# EAGLE design PI_Shield (EAGLE 9.6.2)

## Sheet 1 of 3
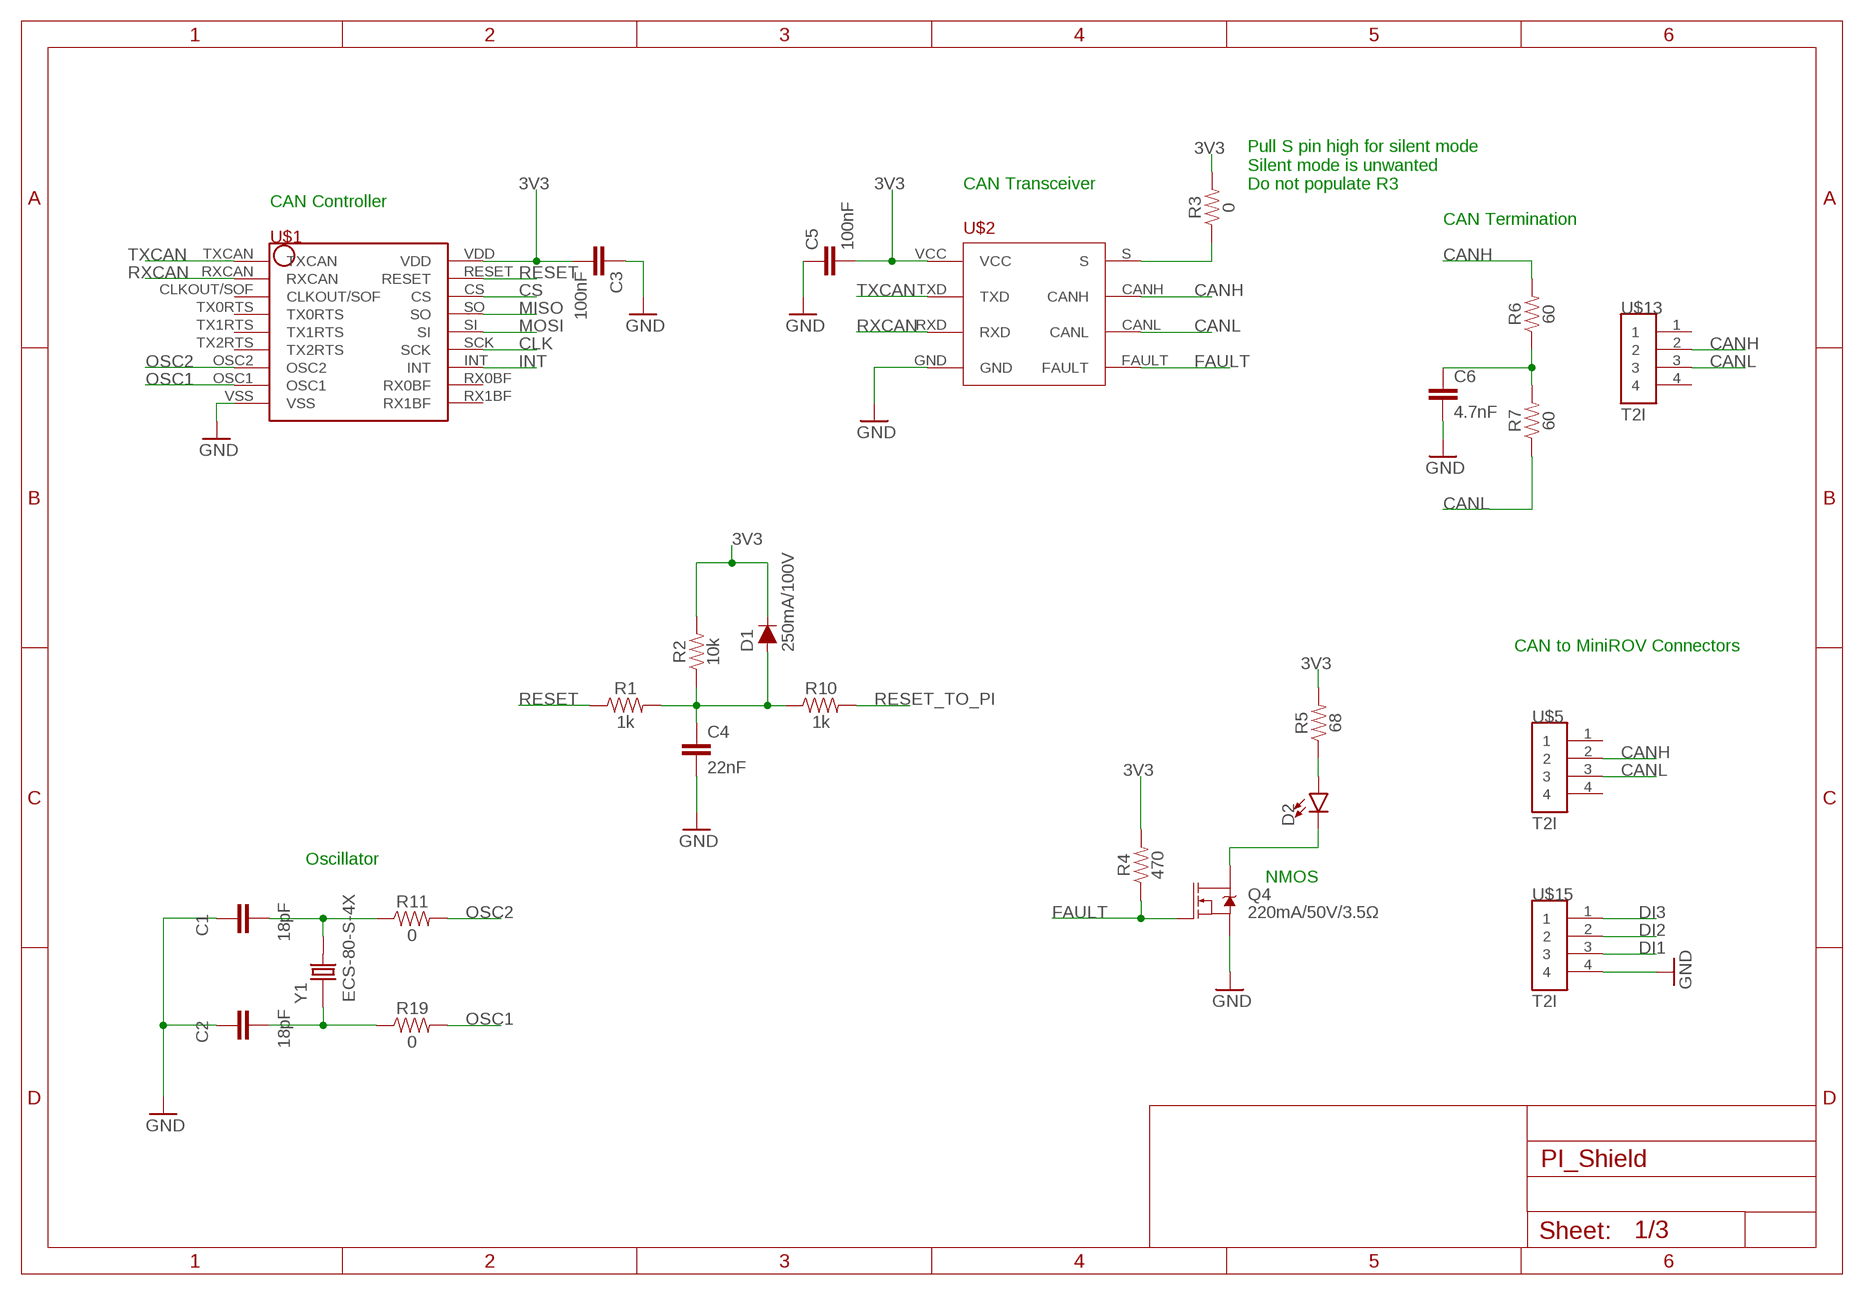
[diagram p0: schematic, sheet 1]

### Parts
C1  18pF  C0603C180J5GACTU  [CAP_0603]
C2  18pF  C0603C180J5GACTU  [CAP_0603]
C3  100nF  22NF/22,000PF-0603-50V-10%  [0603]
C4  22nF  22NF/22,000PF-0603-50V-10%  [0603]
C5  100nF  22NF/22,000PF-0603-50V-10%  [0603]
C6  4.7nF  22NF/22,000PF-0603-50V-10%  [0603]
D1  250mA/100V  DIODE-BAS16J  [SOD-323]
D2  LED0603  [LED-0603]
Q4  220mA/50V/3.5Ω  MOSFET-NCH-BSS138  [SOT23-3]
R1  1k  RESISTOR0603  [0603]
R2  10k  RESISTOR0603  [0603]
R3  0  RESISTOR0603  [0603]
R4  470  RESISTOR0603  [0603]
R5  68  RESISTOR0603  [0603]
R6  60  RESISTOR0603  [0603]
R7  60  RESISTOR0603  [0603]
R10  1k  RESISTOR0603  [0603]
R11  0  RESISTOR0603  [0603]
R19  0  RESISTOR0603  [0603]
U$1  MCP2515  [MCP2515]
U$2  TCAN337D  [TCAN337D]
U$5  T2I  [T2I]
U$13  T2I  [T2I]
U$15  T2I  [T2I]
Y1  ECS-80-S-4X  [XTAL_ECS-80-S-4X]

### Nets
3V3: C3.2 C5.2 D1.C R2.2 R3.2 R4.2 R5.2 U$1.VDD U$2.VCC ; also sheet 2,3
CANH: R6.2 U$2.CANH U$5.2 U$13.2 ; also sheet 2
CANL: R7.1 U$2.CANL U$5.3 U$13.3 ; also sheet 2
CLK: U$1.SCK ; also sheet 2
CS: U$1.CS ; also sheet 2
DI1: U$15.3 ; also sheet 2
DI2: U$15.2 ; also sheet 2
DI3: U$15.1 ; also sheet 2
FAULT: Q4.1(G) R4.1 U$2.FAULT
GND: C1.1 C2.1 C3.1 C4.2 C5.1 C6.2 Q4.2(S) U$1.VSS U$2.GND U$15.4 ; also sheet 2,3
INT: U$1.INT ; also sheet 2
MISO: U$1.SO ; also sheet 2
MOSI: U$1.SI ; also sheet 2
N$1: R3.1 U$2.S
N$2: C1.2 R11.1 Y1.2
N$3: C2.2 R19.1 Y1.1
N$6: C6.1 R6.1 R7.2
N$7: D2.C Q4.3(D)
N$8: D2.A R5.1
N$9: C4.1 D1.A R1.2 R2.1 R10.1
OSC1: R19.2 U$1.OSC1
OSC2: R11.2 U$1.OSC2
RESET: R1.1 U$1.RESET
RESET_TO_PI: R10.2 ; also sheet 2
RXCAN: U$1.RXCAN U$2.RXD
TXCAN: U$1.TXCAN U$2.TXD
Unconnected: U$1.CLKOUT/SOF U$1.RX0BF U$1.RX1BF U$1.TX0RTS U$1.TX1RTS U$1.TX2RTS U$5.1 U$5.4 U$13.1 U$13.4

### Notes on the sheet
- CAN Transceiver
- Pull S pin high for silent mode
  Silent mode is unwanted
  Do not populate R3
- CAN Controller
- CAN Termination
- CAN to MiniROV Connectors
- Oscillator
- NMOS

## Sheet 2 of 3
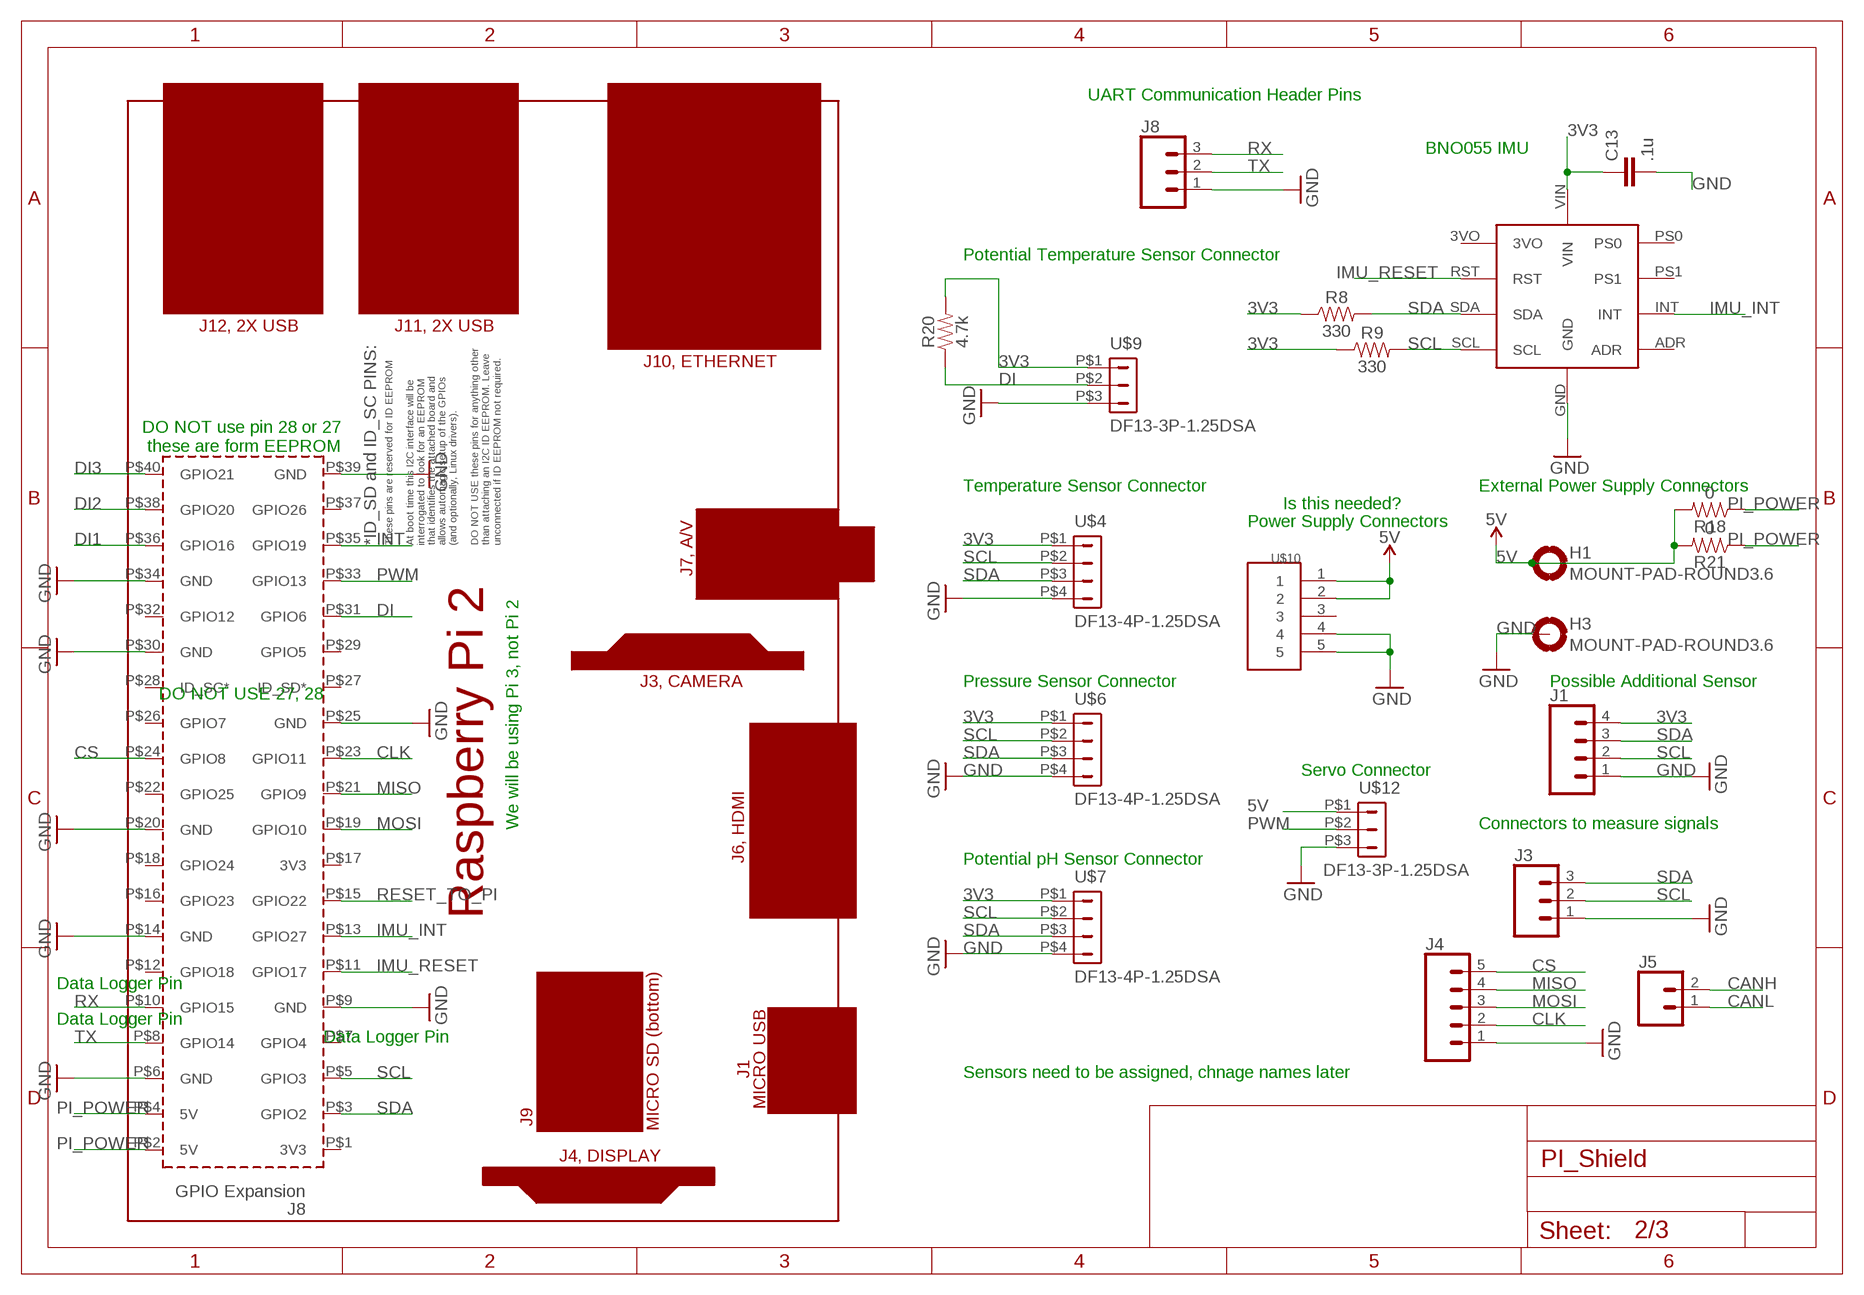
[diagram p1: schematic, sheet 2]

### Parts
C13  .1u  22NF/22,000PF-0603-50V-10%  [0603]
H1  MOUNT-PAD-ROUND3.6  [3,6-PAD]
H3  MOUNT-PAD-ROUND3.6  [3,6-PAD]
J1  CONN_04  [1X04]
J3  CONN_03  [1X03]
J4  CONN_05  [1X05]
J5  CONN_02  [1X02]
J8  CONN_03  [1X03]
PCB1  RPI2  [RPI2]
R8  330  RESISTOR0603  [0603]
R9  330  RESISTOR0603  [0603]
R18  0  RESISTOR0603  [0603]
R20  4.7k  RESISTOR0603  [0603]
R21  0  RESISTOR0603  [0603]
U$3  BNO055_9DOF_BREAKOUT  [BNO055]
U$4  DF13-4P-1.25DSA  [DF13-4P-1.25DSA]
U$6  DF13-4P-1.25DSA  [DF13-4P-1.25DSA]
U$7  DF13-4P-1.25DSA  [DF13-4P-1.25DSA]
U$9  DF13-3P-1.25DSA  [DF13-3P-1.25DSA]
U$10  T2I5P  [T2I5P]
U$12  DF13-3P-1.25DSA  [DF13-3P-1.25DSA]

### Nets
3V3: C13.1 J1.4 R8.1 R9.1 R20.2 U$3.VIN U$4.P$1 U$6.P$1 U$7.P$1 U$9.P$1 ; also sheet 1,3
5V: H1.B3,6(MOUNT) R18.2 R21.2 U$10.1 U$10.2 U$12.P$1 ; also sheet 3
CANH: J5.2 ; also sheet 1
CANL: J5.1 ; also sheet 1
CLK: J4.2 PCB1.P$23(GPIO11) ; also sheet 1
CS: J4.5 PCB1.P$24(GPIO8) ; also sheet 1
DI: PCB1.P$31(GPIO6) R20.1 U$9.P$2
DI1: PCB1.P$36(GPIO16) ; also sheet 1
DI2: PCB1.P$38(GPIO20) ; also sheet 1
DI3: PCB1.P$40(GPIO21) ; also sheet 1
GND: C13.2 H3.B3,6(MOUNT) J1.1 J3.1 J4.1 J8.1 PCB1.P$6(GND) PCB1.P$9(GND) PCB1.P$14(GND) PCB1.P$20(GND) PCB1.P$25(GND) PCB1.P$30(GND) PCB1.P$34(GND) PCB1.P$39(GND) U$3.GND U$4.P$4 U$6.P$4 U$7.P$4 U$9.P$3 U$10.4 U$10.5 U$12.P$3 ; also sheet 1,3
IMU_INT: PCB1.P$13(GPIO27) U$3.INT
IMU_RESET: PCB1.P$11(GPIO17) U$3.RST
INT: PCB1.P$35(GPIO19) ; also sheet 1
MISO: J4.4 PCB1.P$21(GPIO9) ; also sheet 1
MOSI: J4.3 PCB1.P$19(GPIO10) ; also sheet 1
PI_POWER: PCB1.P$2(5V) PCB1.P$4(5V) R18.1 R21.1
PWM: PCB1.P$33(GPIO13) U$12.P$2
RESET_TO_PI: PCB1.P$15(GPIO22) ; also sheet 1
RX: J8.3 PCB1.P$10(GPIO15)
SCL: J1.2 J3.2 PCB1.P$5(GPIO3) R9.2 U$3.SCL U$4.P$2 U$6.P$2 U$7.P$2 ; also sheet 3
SDA: J1.3 J3.3 PCB1.P$3(GPIO2) R8.2 U$3.SDA U$4.P$3 U$6.P$3 U$7.P$3 ; also sheet 3
TX: J8.2 PCB1.P$8(GPIO14)
Unconnected: PCB1.P$1(3V3) PCB1.P$7(GPIO4) PCB1.P$12(GPIO18) PCB1.P$16(GPIO23) PCB1.P$17(3V3) PCB1.P$18(GPIO24) PCB1.P$22(GPIO25) PCB1.P$26(GPIO7) PCB1.P$27(ID_SD*) PCB1.P$28(ID_SC*) PCB1.P$29(GPIO5) PCB1.P$32(GPIO12) PCB1.P$37(GPIO26) U$3.3VO U$3.ADR U$3.PS0 U$3.PS1 U$10.3

### Notes on the sheet
- UART Communication Header Pins
- BNO055 IMU
- Potential Temperature Sensor Connector
- DO NOT use pin 28 or 27
   these are form EEPROM
- Temperature Sensor Connector | External Power Supply Connectors
- Is this needed?
- Power Supply Connectors
- DO NOT USE 27, 28 | Pressure Sensor Connector | Possible Additional Sensor
- Servo Connector
- We will be using Pi 3, not Pi 2 | Connectors to measure signals
- Potential pH Sensor Connector
- Data Logger Pin
- Data Logger Pin
- Data Logger Pin
- Sensors need to be assigned, chnage names later

## Sheet 3 of 3
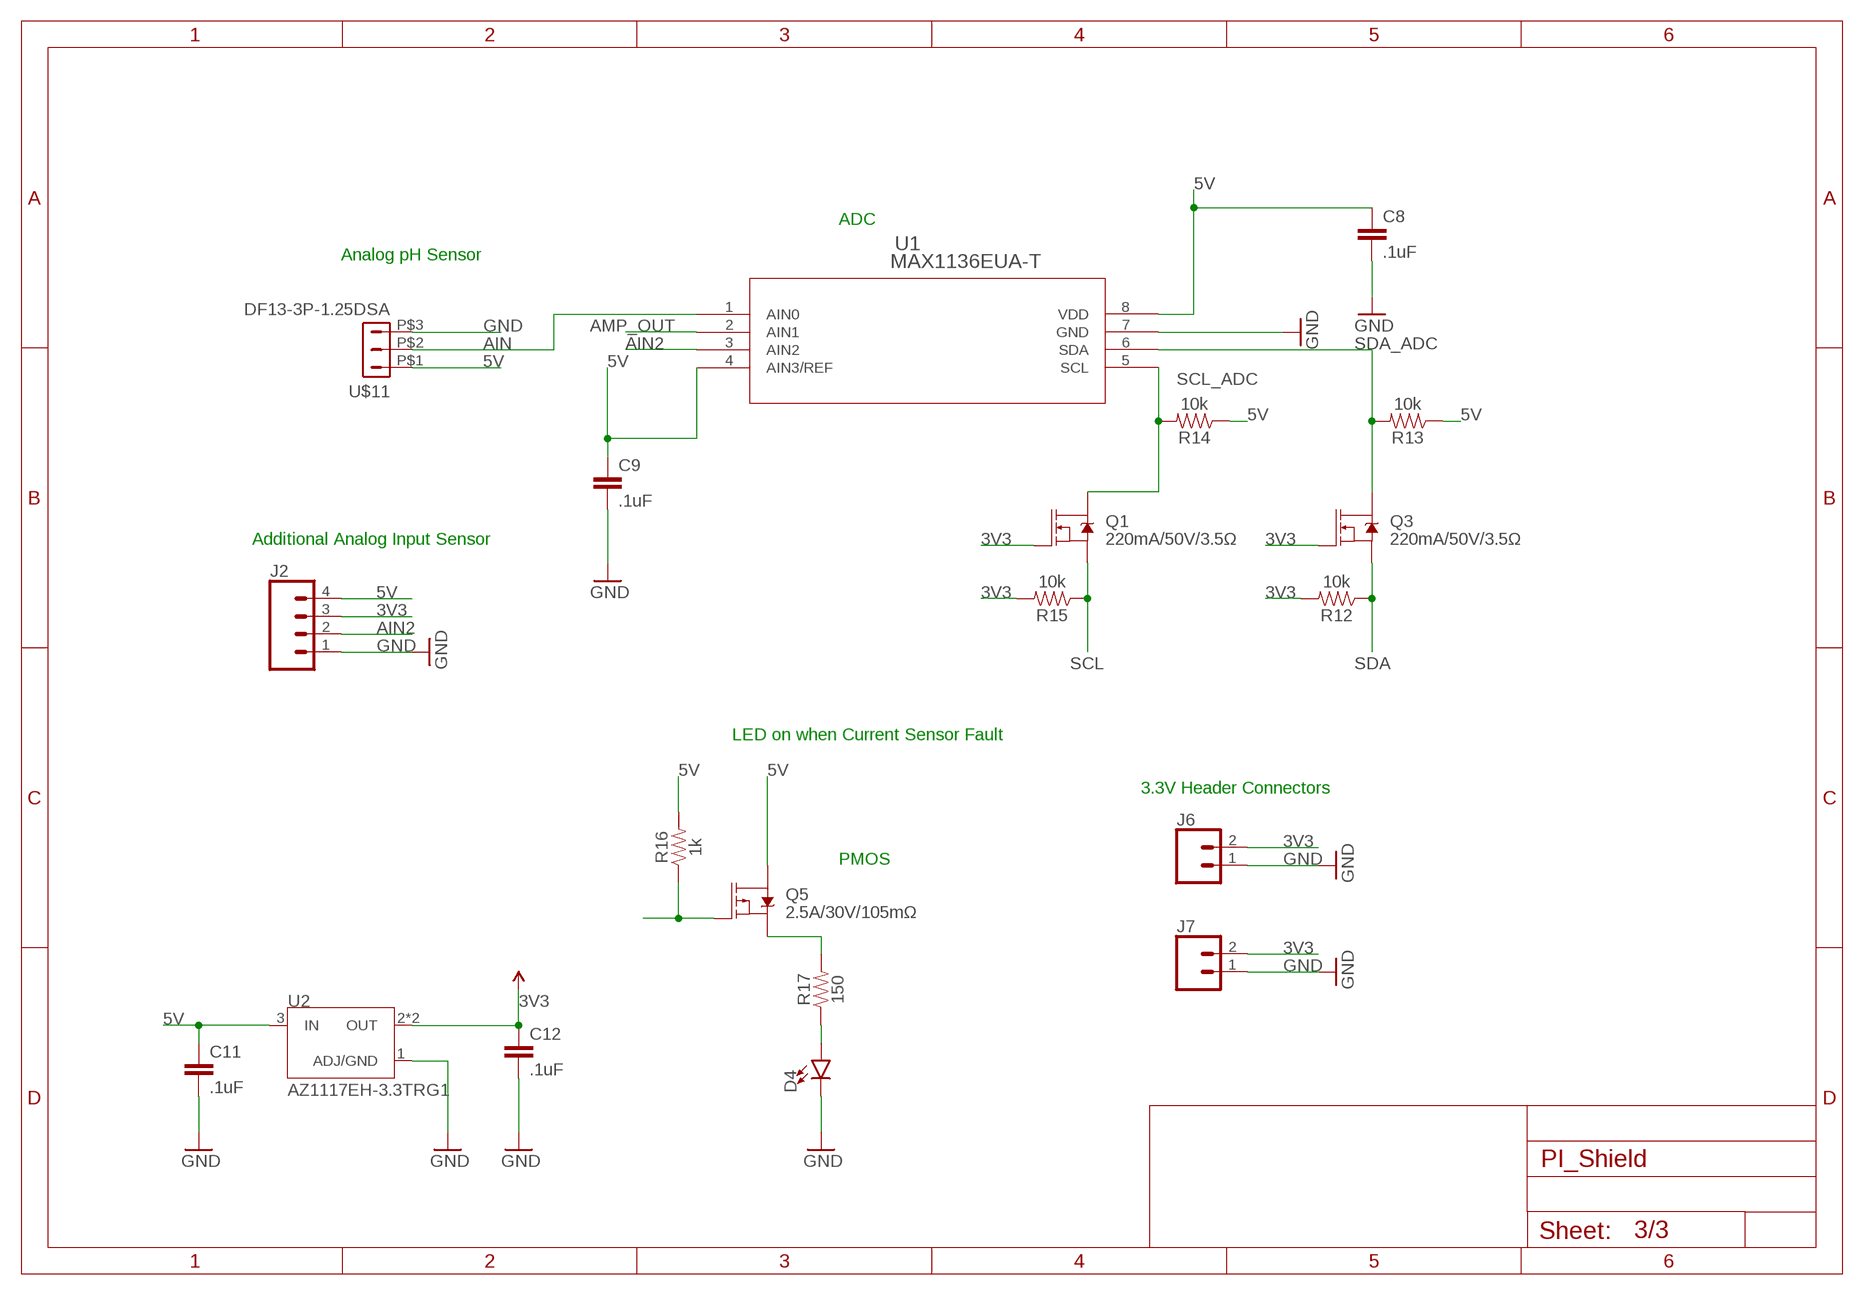
[diagram p2: schematic, sheet 3]

### Parts
C8  .1uF  22NF/22,000PF-0603-50V-10%  [0603]
C9  .1uF  22NF/22,000PF-0603-50V-10%  [0603]
C11  .1uF  22NF/22,000PF-0603-50V-10%  [0603]
C12  .1uF  22NF/22,000PF-0603-50V-10%  [0603]
D4  LED0603  [LED-0603]
J2  CONN_04  [1X04]
J6  CONN_02  [1X02]
J7  CONN_02  [1X02]
Q1  220mA/50V/3.5Ω  MOSFET-NCH-BSS138  [SOT23-3]
Q3  220mA/50V/3.5Ω  MOSFET-NCH-BSS138  [SOT23-3]
Q5  2.5A/30V/105mΩ  MOSFET_PCH-DMG2307L  [SOT23-3]
R12  10k  RESISTOR0603  [0603]
R13  10k  RESISTOR0603  [0603]
R14  10k  RESISTOR0603  [0603]
R15  10k  RESISTOR0603  [0603]
R16  1k  RESISTOR0603  [0603]
R17  150  RESISTOR0603  [0603]
U1  MAX1136EUA-T  [21-0036K]
U2  AZ1117EH-3.3TRG1  [SOT230P700X180-4N]
U$11  DF13-3P-1.25DSA  [DF13-3P-1.25DSA]

### Nets
3V3: C12.1 J2.3 J6.2 J7.2 Q1.1(G) Q3.1(G) R12.2 R15.2 U2.2(OUT) U2.4(OUT) ; supply symbol labelled 3.3V ; also sheet 1,2
5V: C8.1 C9.1 C11.1 J2.4 Q5.3(D) R13.1 R14.1 R16.2 U1.4(AIN3/REF) U1.8(VDD) U2.3(IN) U$11.P$1 ; also sheet 2
AIN: U1.1(AIN0) U$11.P$2
AIN2: J2.2 U1.3(AIN2)
AMP_FAULT: Q5.1(G) R16.1
AMP_OUT: U1.2(AIN1)
GND: C8.2 C9.2 C11.2 C12.2 D4.C J2.1 J6.1 J7.1 U1.7(GND) U2.1(ADJ/GND) U$11.P$3 ; also sheet 1,2
N$10: Q5.2(S) R17.2
N$11: D4.A R17.1
SCL: Q1.2(S) R15.1 ; also sheet 2
SCL_ADC: Q1.3(D) R14.2 U1.5(SCL)
SDA: Q3.2(S) R12.1 ; also sheet 2
SDA_ADC: Q3.3(D) R13.2 U1.6(SDA)

### Notes on the sheet
- ADC
- Analog pH Sensor
- Additional Analog Input Sensor
- LED on when Current Sensor Fault
- 3.3V Header Connectors
- PMOS

## Library data of the parts
C1 C2 = Resistor_Capacitor:C0603C180J5GACTU: CAP CER 18PF 50V C0G/NP0 0603 Manufacturer's datasheet <https://content.kemet.com/datasheets/KEM_C1003_C0G_SMD.pdf>; CREATED_BY: PCBLayout.com; DIGIKEY_PART_NUMBER: 399-1052-2-ND; MANUFACTURER: KEMET; MPN: C0603C180J5GACTU; PACKAGE: SMD 0603
C3 C5 C6 C8 C9 C11-C13 = SparkFun-Capacitors:22NF/22,000PF: 0.022uF/22nF/22,000pF ceramic capacitors A capacitor is a passive two-terminal electrical component used to store electrical energy temporarily in an electric field.; PROD_ID: CAP-07885; VALUE: 22nF
C4 = SparkFun-Capacitors:22NF/22,000PF: 0.022uF/22nF/22,000pF ceramic capacitors A capacitor is a passive two-terminal electrical component used to store electrical energy temporarily in an electric field.; PROD_ID: CAP-07885
D1 = SparkFun-DiscreteSemi:DIODE: Diode These are standard reverse protection diodes and small signal diodes. SparkFun Products: SparkFun SparkPunk Sound Kit <https://www.sparkfun.com/products/11177> SparkFun ESP8266 Thing <https://www.sparkfun.com/products/13231>; PROD_ID: DIO-09646
D2 D4 = SparkFun-LED:LED: LED (Generic) Standard schematic elements and footprints for 5mm, 3mm, 1206, and 0603 sized LEDs. Generic LEDs with no color specified.
H1 H3 = holes:MOUNT-PAD-ROUND: MOUNTING PAD, round
J1 J2 = SparkFun-Connectors:CONN_04: Multi connection point. Often used as Generic Header-pin footprint for 0.1 inch spaced/style header connections On any of the 0.1 inch spaced packages, you can populate with these: Break Away Headers - Straight <https://www.sparkfun.com/products/116> (PRT-00116) Break Away Male Headers - Right Angle <https://www.sparkfun.com/products/553> (PRT-00553) Female Headers <https://www.sparkfun.com/products/115> (PRT-00115) Break Away Headers - Machine Pin <https://www.sparkfun.com/products/117> (PRT-00117) Break Away Female Headers - Swiss Machine Pin <https://www.sparkfun.com/products/743> (PRT-00743) For SCREWTERMINALS and SPRING TERMINALS visit here: Screw Terimnals on SparkFun.com <https://www.sparkfun.com/search/results?term=Screw+Terminals> (5mm/3.5mm/2.54mm spacing) This device is also useful as a general connection point to wire up your design to another part of your project. Our various solder wires solder well into these plated through hole pads. Hook-Up Wire - Assortment (Stranded, 22 AWG) <https://www.sparkfun.com/products/11375> (PRT-11375) Hook-Up Wire - Assortment (Solid Core, 22 AWG) <https://www.sparkfun.com/products/11367> (PRT-11367) View the entire wire category on our website here <https://www.sparkfun.com/categories/141> Special notes: Molex polarized connector foot print use with SKU : PRT-08231 with associated crimp pins and housings. 1MM SMD Version SKU: PRT-10208; PROD_ID: CONN-09696
J3 J8 = SparkFun-Connectors:CONN_03: Multi connection point. Often used as Generic Header-pin footprint for 0.1 inch spaced/style header connections On any of the 0.1 inch spaced packages, you can populate with these: Break Away Headers - Straight <https://www.sparkfun.com/products/116> (PRT-00116) Break Away Male Headers - Right Angle <https://www.sparkfun.com/products/553> (PRT-00553) Female Headers <https://www.sparkfun.com/products/115> (PRT-00115) Break Away Headers - Machine Pin <https://www.sparkfun.com/products/117> (PRT-00117) Break Away Female Headers - Swiss Machine Pin <https://www.sparkfun.com/products/743> (PRT-00743) Stackable Header - 3 Pin (Female, 0.1") <https://www.sparkfun.com/products/13875> (PRT-13875) For SCREWTERMINALS and SPRING TERMINALS visit here: Screw Terimnals on SparkFun.com <https://www.sparkfun.com/search/results?term=Screw+Terminals> (5mm/3.5mm/2.54mm spacing) This device is also useful as a general connection point to wire up your design to another part of your project. Our various solder wires solder well into these plated through hole pads. Hook-Up Wire - Assortment (Stranded, 22 AWG) <https://www.sparkfun.com/products/11375> (PRT-11375) Hook-Up Wire - Assortment (Solid Core, 22 AWG) <https://www.sparkfun.com/products/11367> (PRT-11367) View the entire wire category on our website here <https://www.sparkfun.com/categories/141> Special notes: Molex polarized connector foot print use with SKU : PRT-08232 with associated crimp pins and housings.
J4 = SparkFun-Connectors:CONN_05: Multi connection point. Often used as Generic Header-pin footprint for 0.1 inch spaced/style header connections On any of the 0.1 inch spaced packages, you can populate with these: Break Away Headers - Straight <https://www.sparkfun.com/products/116> (PRT-00116) Break Away Male Headers - Right Angle <https://www.sparkfun.com/products/553> (PRT-00553) Female Headers <https://www.sparkfun.com/products/115> (PRT-00115) Break Away Headers - Machine Pin <https://www.sparkfun.com/products/117> (PRT-00117) Break Away Female Headers - Swiss Machine Pin <https://www.sparkfun.com/products/743> (PRT-00743) For SCREWTERMINALS and SPRING TERMINALS visit here: Screw Terimnals on SparkFun.com <https://www.sparkfun.com/search/results?term=Screw+Terminals> (5mm/3.5mm/2.54mm spacing) This device is also useful as a general connection point to wire up your design to another part of your project. Our various solder wires solder well into these plated through hole pads. Hook-Up Wire - Assortment (Stranded, 22 AWG) <https://www.sparkfun.com/products/11375> (PRT-11375) Hook-Up Wire - Assortment (Solid Core, 22 AWG) <https://www.sparkfun.com/products/11367> (PRT-11367) View the entire wire category on our website here <https://www.sparkfun.com/categories/141> Special notes: Molex polarized connector foot print use with SKU : PRT-08231 with associated crimp pins and housings. 1MM SMD Version SKU: PRT-10208
J5-J7 = SparkFun-Connectors:CONN_02: Multi connection point. Often used as Generic Header-pin footprint for 0.1 inch spaced/style header connections On any of the 0.1 inch spaced packages, you can populate with these: Break Away Headers - Straight <https://www.sparkfun.com/products/116> (PRT-00116) Break Away Male Headers - Right Angle <https://www.sparkfun.com/products/553> (PRT-00553) Female Headers <https://www.sparkfun.com/products/115> (PRT-00115) Break Away Headers - Machine Pin <https://www.sparkfun.com/products/117> (PRT-00117) Break Away Female Headers - Swiss Machine Pin <https://www.sparkfun.com/products/743> (PRT-00743) For SCREWTERMINALS and SPRING TERMINALS visit here: Screw Terimnals on SparkFun.com <https://www.sparkfun.com/search/results?term=Screw+Terminals> (5mm/3.5mm/2.54mm spacing) This device is also useful as a general connection point to wire up your design to another part of your project. Our various solder wires solder well into these plated through hole pads. Hook-Up Wire - Assortment (Stranded, 22 AWG) <https://www.sparkfun.com/products/11375> (PRT-11375) Hook-Up Wire - Assortment (Solid Core, 22 AWG) <https://www.sparkfun.com/products/11367> (PRT-11367) View the entire wire category on our website here <https://www.sparkfun.com/categories/141> Special notes: Molex polarized connector foot print use with: PRT-08233 with associated crimp pins and housings. 2.54_SCREWTERM for use with PRT-10571. 3.5mm Screw Terminal footprints for PRT-08084 5mm Screw Terminal footprints for use with PRT-08432
PCB1 = MicrocontrollerComponents:RPI2: Device for Raspberry Pi 2 board created by www.element14.com More information and support community is available at http://www.element14.com/community/community/raspberry-pi/raspberrypi2
Q1 Q3 Q4 = SparkFun-DiscreteSemi:MOSFET-NCH: N-channel MOSFETs Voltage controlled devices that allow control of high current outputs. SparkFun Products: SparkFun OpenScale <https://www.sparkfun.com/products/13261> SparkFun Digital Sandbox <https://www.sparkfun.com/products/12651> SparkFun Monster Moto Shield <https://www.sparkfun.com/products/10182> SparkFun MOSFET Power Controller <https://www.sparkfun.com/products/11214>; PROD_ID: TRANS-00830
Q5 = SparkFun-DiscreteSemi:MOSFET_PCH: P-channel MOSFETs Voltage controlled devices that allow control of high current outputs. SparkFun Products: SparkFun ESP32 Thing <https://www.sparkfun.com/products/13907> SparkFun ESP8266 Thing <https://www.sparkfun.com/products/13231>; PROD_ID: TRANS-11308
R1-R21 = SparkFun-Resistors:RESISTOR: Generic Resistor Package
U1 = MAX1136EUA-T:MAX1136EUA-T; DESCRIPTION: 2.7V to 3.6V and 4.5V to 5.5V, Low-Power, 4-/12-Channel, 2-Wire Serial 10-Bit AD; DIGI-KEY_PART_NUMBER: MAX1136EUA+-ND; DIGI-KEY_PURCHASE_URL: https://www.digikey.com/product-detail/en/maxim-integrated/MAX1136EUA-/MAX1136EUA--ND/1159953?utm_source=snapeda&utm_medium=aggregator&utm_campaign=symbol; MF: Maxim Integrated; MP: MAX1136EUA+; PACKAGE: MSOP-8 Maxim Integrated
U2 = AZ1117EH-3.3TRG1:AZ1117EH-3.3TRG1: Ldo.Vreg Pos 3, 3v 1a Sot223; AVAILABILITY: Unavailable; DESCRIPTION: Ldo.Vreg Pos 3, 3v 1a Sot223; MF: Diodes Inc.; MP: AZ1117EH-3.3TRG1; PACKAGE: SOT-223 Diodes Inc.; PRICE: None
U$1 = PI_Shield_Library:MCP2515
U$2 = PI_Shield_Library:TCAN337D
U$3 = Other:BNO055_9DOF_BREAKOUT
U$4 U$6 U$7 = con-hirose-df13:DF13-4P-1.25: DF13-4P 1.25mm Pitch Miniature Crimping Connector.
U$5 U$13 U$15 = Samtec t2i:T2I
U$9 U$11 U$12 = con-hirose-df13:DF13-3P-1.25: DF13-3P 1.25mm Pitch Miniature Crimping Connector.
U$10 = Samtec t2i:T2I5P
Y1 = ECS-80-S-4X:ECS-80-S-4X: CRYSTAL T/H; DESCRIPTION: Crystal 8MHz Series 2-Pin HC-49/U; DIGI-KEY_PART_NUMBER: X1057-ND; DIGI-KEY_PURCHASE_URL: https://www.digikey.com/product-detail/en/ecs-inc/ECS-80-S-4X/X1057-ND/827549?utm_source=snapeda&utm_medium=aggregator&utm_campaign=symbol; MF: ECS International; MP: ECS-80-S-4X; PACKAGE: HC-49/US ECS International

## Board
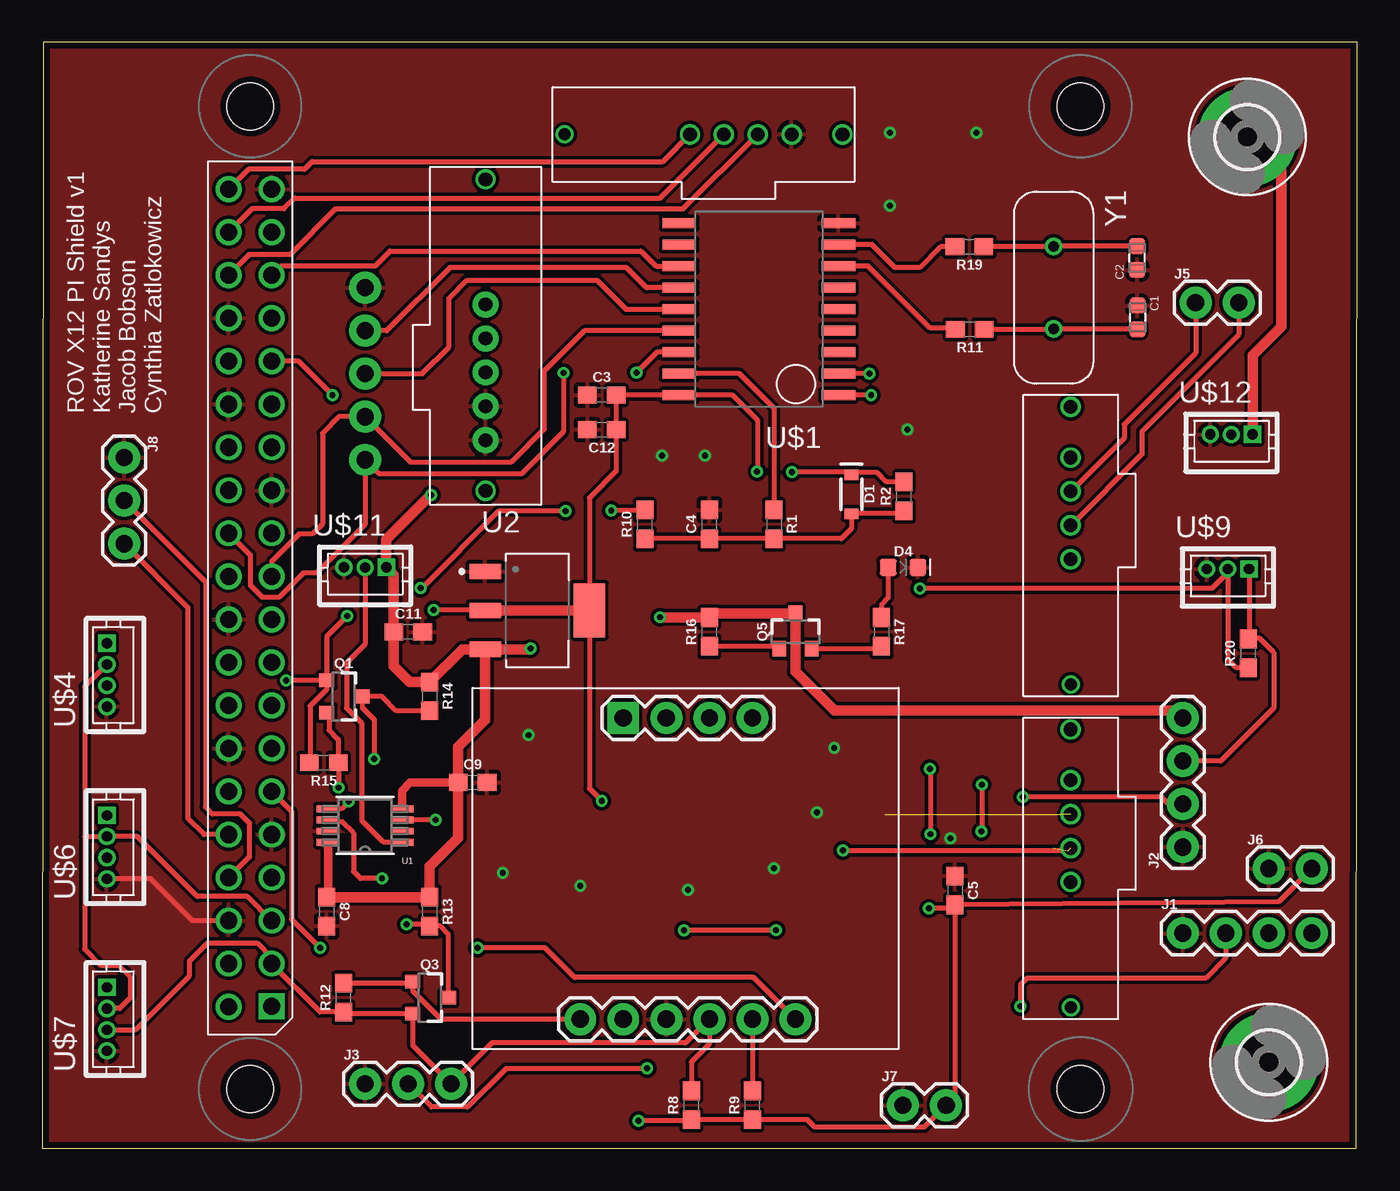
[diagram p3: board, top side]
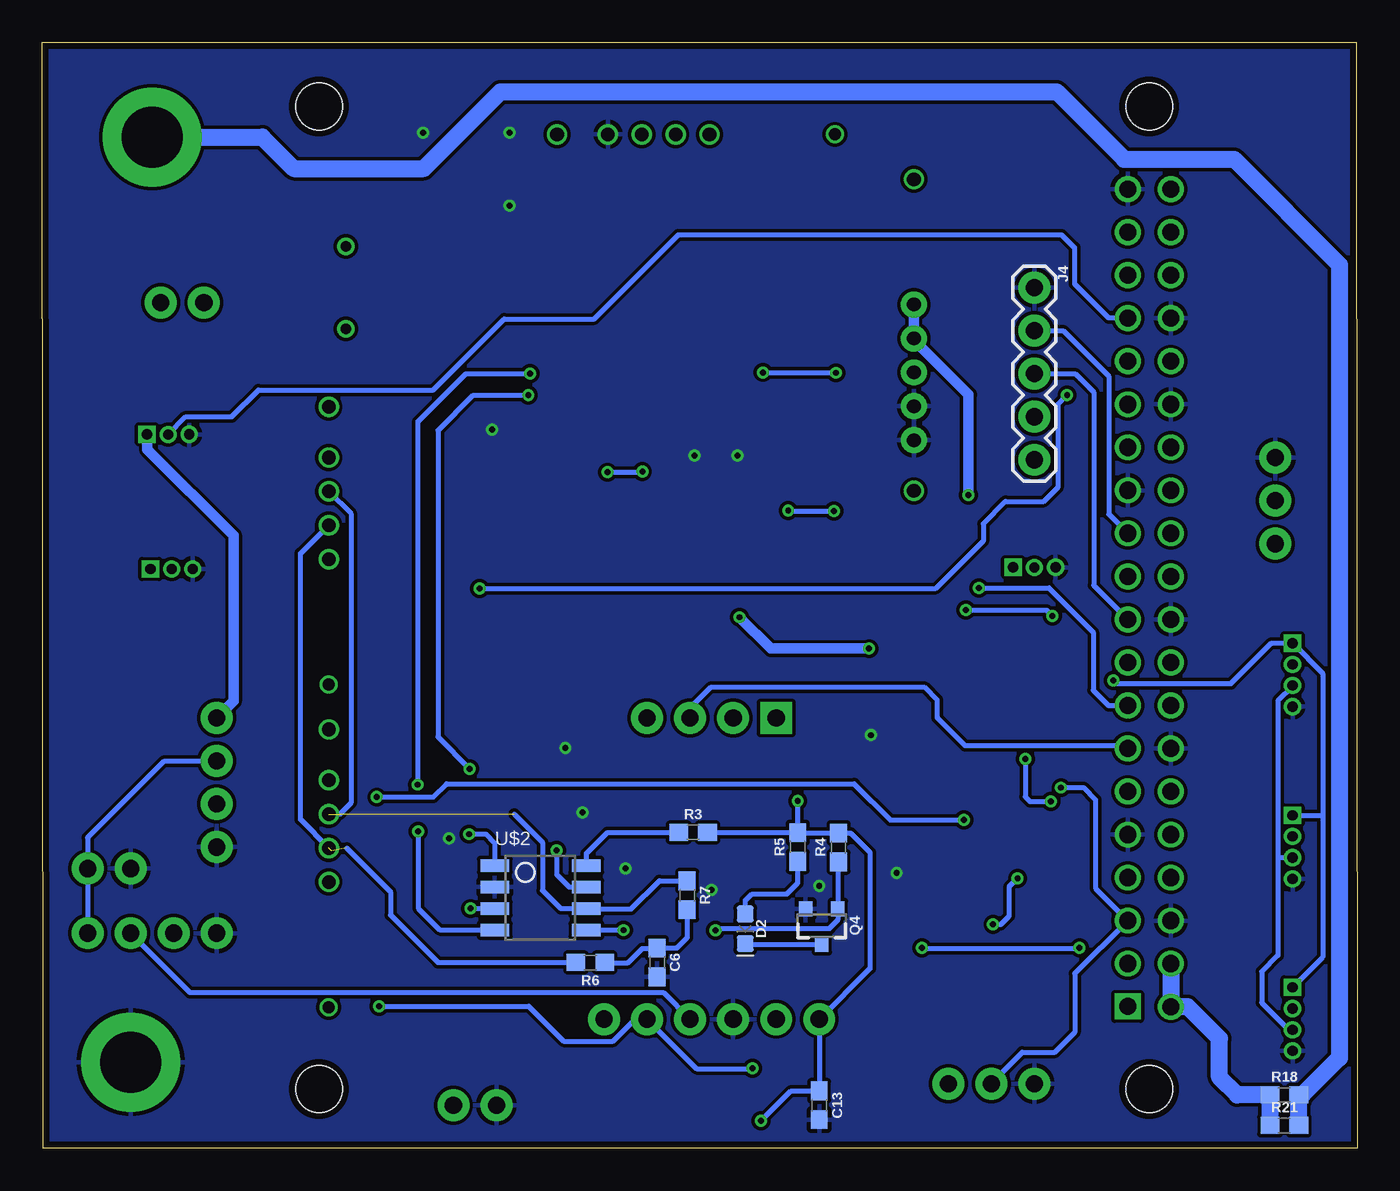
[diagram p4: board, bottom side, seen from below]

Size 77.6 x 65.28 mm. Coordinates in mm from the lower left corner, seen from the top.
Outline: 0,0 77.55,0 77.6,65.28 0.05,65.28 0,0
Copper layers (1*16): Top 0.0356mm / dielectric 1.5011mm / Bottom 0.0356mm
Design rules "ECE_Senior_Design": minimum track width 8mil, minimum drill 13mil, track to track 8mil, track to pad 8mil, pad to pad 6mil, via to via 8mil, smd to smd 6mil, copper to edge 15mil, drill to drill 8mil, minimum pad ring 7mil, minimum via ring 7mil, stop-mask expansion 3mil, vias tented up to drill 0mil, thermal gap 10mil

### Footprints (pad centres in the part's own frame; a part is rotated, then mirrored left to right if it is on the bottom)
CAP_0603 = smd 0.92 x 0.93: 1 -0.705,0; 2 0.705,0
0603 = smd 1.1 x 1: 1 -0.85,0; 2 0.85,0
SOD-323 = smd 0.63 x 0.83: A 1.15,0; C -1.15,0
LED-0603 = smd 1 x 1: A -0.877,0; C 0.877,0
3,6-PAD = drill 3.6 pad 5.842: B3,6 0,0
1X04 = drill 1.016 pad 1.88: 1 0,0; 2 2.54,0; 3 5.08,0; 4 7.62,0
1X03 = drill 1.016 pad 1.88: 1 0,0; 2 2.54,0; 3 5.08,0
1X05 = drill 1.016 pad 1.88: 1 0,0; 2 2.54,0; 3 5.08,0; 4 7.62,0; 5 10.16,0
1X02 = drill 1.016 pad 1.88: 1 0,0; 2 2.54,0
RPI2 = drill 1.016 square: P$1 8.37,51.23 | drill 1.016: P$2 8.357,53.772; P$3 10.897,51.232; P$4 10.897,53.772; P$5 13.437,51.232; P$6 13.437,53.772; P$7 15.977,51.232; P$8 15.977,53.772; P$9 18.517,51.232; P$10 18.517,53.772; P$11 21.057,51.232; P$12 21.057,53.772; P$13 23.597,51.232; P$14 23.597,53.772; P$15 26.137,51.232; P$16 26.137,53.772; P$17 28.677,51.232; P$18 28.677,53.772; P$19 31.217,51.232; P$20 31.217,53.772; P$21 33.757,51.232; P$22 33.757,53.772; P$23 36.297,51.232; P$24 36.297,53.772; P$25 38.837,51.232; P$26 38.837,53.772; P$27 41.377,51.232; P$28 41.377,53.772; P$29 43.917,51.232; P$30 43.917,53.772; P$31 46.457,51.232; P$32 46.457,53.772; P$33 48.997,51.232; P$34 48.997,53.772; P$35 51.537,51.232; P$36 51.537,53.772; P$37 54.077,51.232; P$38 54.077,53.772; P$39 56.617,51.232; P$40 56.617,53.772 | hole 2.75: 3.5,3.5; 61.5,3.5; 3.5,52.5; 61.5,52.5
SOT23-3 = smd 0.8 x 0.9: 1 -0.95,-1; 2 0.95,-1; 3 0,1.1
21-0036K = smd 1.372 x 0.406: 1 -2.184,0.991; 2 -2.184,0.33; 3 -2.184,-0.33; 4 -2.184,-0.991; 5 2.184,-0.991; 6 2.184,-0.33; 7 2.184,0.33; 8 2.184,0.991
SOT230P700X180-4N = smd 1.86 x 0.9: 1 -3.075,2.3; 2 -3.075,0; 3 -3.075,-2.3 | smd 1.86 x 3.19: 4 3.075,0
MCP2515 = smd 2 x 0.6: CLKOUT/SOF 0,7.62; CS 9.4,7.62; INT 9.4,2.54; OSC1 0,1.27; OSC2 0,2.54; RESET 9.4,8.89; RX0BF 9.4,1.27; RX1BF 9.4,0; RXCAN 0,8.89; SCK 9.4,3.81; SI 9.4,5.08; SO 9.4,6.35; TX0RTS 0,6.35; TX1RTS 0,5.08; TX2RTS 0,3.81; TXCAN 0,10.16; VDD 9.4,10.16; VSS 0,0
TCAN337D = smd 1.7 x 0.75: CANH 5.4,2.54; CANL 5.4,1.27; FAULT 5.4,0; GND 0,2.54; RXD 0,0; S 5.4,3.81; TXD 0,3.81; VCC 0,1.27
BNO055 = drill 1.016 pad 1.88: 3VO -8.89,2.54; ADR 8.89,-5.08; GND -8.89,0; INT 8.89,-2.54; PS1 8.89,0; RST -8.89,-7.62; SCL -8.89,-5.08; SDA -8.89,-2.54; VIN -8.89,5.08 | drill 1.016 pad 1.88 square: PS0 8.89,2.54
DF13-4P-1.25DSA = drill 0.6 pad 1.016 square: P$1 1.875,0 | drill 0.6 pad 1.016: P$2 0.625,0; P$3 -0.625,0; P$4 -1.875,0
T2I = drill 0.8: 1 8.1,2.8; 2 10.1,2.8; 3 12.1,2.8; 4 14.1,2.8; S2 17.1,2.8 | drill 0.7: S1 0.7,2.8
DF13-3P-1.25DSA = drill 0.6 pad 1.016 square: P$1 1.25,0.005 | drill 0.6 pad 1.016: P$2 0,-0.005; P$3 -1.25,0
T2I5P = drill 0.8 pad 1.524: 1 -11.7,3.3; 2 -9.7,3.3; 3 -7.7,3.3; 4 -5.7,3.3; 5 -3.7,3.3 | drill 0.8: P$1 -19.1,3.3; P$7 -0.7,3.3
XTAL_ECS-80-S-4X = drill 0.63 pad 1.03: 1 -2.44,0; 2 2.44,0

### Placement (x,y rotation side)
C1  64.64,49.05 270 top
C2  64.62,52.55 90 top
C3  33.02,44.45 0 top
C4  39.37,36.83 90 top
C5  53.87,15.21 270 top
C6  41.33,10.97 270 bottom
C8  16.79,13.97 270 top
C9  25.4,21.59 0 top
C11  21.59,30.48 0 top
C12  33.02,42.42 180 top
C13  31.75,2.54 270 bottom
D1  47.75,38.61 270 top
D2  36.12,12.95 270 bottom
D4  50.8,34.29 0 top
H1  71.12,59.69 0 top
H3  72.39,5.08 0 top
J1  67.31,12.7 0 top
J2  67.31,17.78 90 top
J3  19.05,3.81 0 top
J4  19.05,50.8 270 bottom
J5  68.07,49.91 0 top
J6  72.39,16.51 0 top
J7  50.8,2.54 0 top
J8  4.83,40.77 270 top
PCB1  64.77,0 90 top
Q1  17.78,26.67 270 top
Q3  22.86,8.89 270 top
Q4  31.6,13.13 180 bottom
Q5  44.45,30.48 0 top
R1  43.18,36.83 270 top
R2  50.85,38.48 90 top
R3  39.19,18.64 0 bottom
R4  30.61,17.75 90 bottom
R5  33.02,17.78 90 bottom
R6  45.26,10.97 180 bottom
R7  39.55,14.94 270 bottom
R8  38.3,2.54 90 top
R9  41.91,2.54 90 top
R10  35.56,36.83 90 top
R11  54.74,48.34 180 top
R12  17.78,8.89 90 top
R13  22.86,13.97 270 top
R14  22.86,26.67 270 top
R15  16.61,22.76 180 top
R16  39.37,30.48 90 top
R17  49.53,30.48 270 top
R18  4.29,3.15 0 bottom
R19  54.71,53.21 180 top
R20  71.17,29.21 90 top
R21  4.29,1.35 0 bottom
U1  19.05,19.05 180 top
U2  29.21,31.75 0 top
U$1  46.99,54.61 180 top
U$2  50.9,12.88 0 bottom
U$3  36.83,16.51 90 top
U$4  3.81,27.94 90 top
U$5  63.5,26.67 90 top
U$6  3.81,17.78 90 top
U$7  3.81,7.62 90 top
U$9  69.98,34.19 0 top
U$10  22.86,38.1 270 top
U$11  19.05,34.29 0 top
U$12  70.18,42.14 0 top
U$13  63.5,7.62 90 top
U$15  30.12,57.05 0 top
Y1  59.69,50.8 270 top

### Tracks (layer width: path | path; a pad name or v marks a point on that pad's centre or on a via)
3V3  (via drill 0.35)
  Top 0.305: v35.18,1.63 38.24,1.63 R8.1 R9.1 45.14,1.69 45.59,1.25 52.05,1.25 J7.2 53.87,3.07 C5.2 | R12.2 21.76,9.74 Q3.1 21.86,9.31 23.55,7.62 U$3.VIN | R15.2 15.8,22.8 15.8,26.11 16.78,27.09 Q1.1 | U$9.P$1 71.23,30.12 | 71.23,30.12 R20.2 | J2.3 69.55,22.86 72.67,25.98 72.67,29.26 71.81,30.12 71.23,30.12 | v33.02,20.5 32.28,21.23 U2.4 32.28,38.38 33.87,39.97 C12.1 C3.2 U$1.VDD 40.74,44.45 42.22,42.98 42.22,39.98 v42.19,39.95 | Q1.1 v14.4,27.61 | Q1.1 16.78,30.22 v17.98,31.42 | v23.09,31.77 23.1,31.77 26.11,31.77 U2.2 | J6.2 72.97,14.55 C5.2 | R2.2 49.82,39.33 49.28,39.88 47.87,39.88 D1.C 47.61,39.9 v44.25,39.9 | v52.32,14.15 53.66,14.15 C5.2
  Top 0.61: U2.4 U2.2
  Bottom 0.305: v35.18,1.63 33.41,3.39 C13.1 U$3.VIN 28.75,10.62 28.75,17.46 29.9,18.61 R4.2 32.99,18.61 R5.2 | 38.33,18.66 R3.2 33.03,18.64 R5.2 | J2.3 70.41,22.86 74.93,18.34 J6.2 J1.4 | v52.32,14.15 U$2.VCC | v33.02,20.5 R5.2 | 2.05,19.66 2.03,19.63 2.03,11.27 U$7.P$1 | U$6.P$1 2.05,19.66 | 2.05,19.66 2.03,19.68 2.03,28.04 U$4.P$1 5.06,29.82 7.44,27.43 14.22,27.43 v14.4,27.61 | v17.98,31.42 18.33,31.77 v23.09,31.77 | v44.25,39.9 42.24,39.9 v42.19,39.95
5V  (via drill 0.35)
  Top 0.508: U1.4 21.23,21.11 21.72,21.59 C9.1 | C8.1 16.87,14.9 U1.8
  Top 0.61: C8.1 R13.1 22.86,16.64 24.55,18.33 C9.1 24.55,23.69 26.14,25.27 U2.3 | U2.3 24.79,29.45 R14.1 21.68,27.52 20.74,28.46 C11.1 20.74,33.84 20.3,34.28 U$11.P$1 20.3,35.94 22.92,38.56 v22.94,38.56 | J2.4 66.88,25.83 46.77,25.83 44.45,28.14 Q5.3 39.62,31.58 R16.2 39.36,31.34 v36.45,31.34 | U$12.P$1 71.43,46.82 73.13,48.51 73.13,57.68 H1.B3,6 | U2.3 28.76,29.45 v28.8,29.49
  Bottom 0.61: J2.4 66.32,26.39 66.32,36.17 71.41,41.26 71.41,42.12 U$12.P$1 | v28.8,29.49 34.59,29.49 v36.45,31.34 | v22.94,38.56 22.94,44.48 26.16,47.71 U$10.2 U$10.1
  Bottom 1.016: H1.B3,6 64.62,59.69 62.76,57.84 55.09,57.84 50.57,62.36 17.73,62.36 13.74,58.37 7.26,58.37 1.04,52.15 1.04,5.33 3.23,3.15 R18.2 R21.2
AIN
  Top 0.305: U1.1 20.14,18.06 18.85,19.36 18.85,25.09 17.96,25.98 17.96,28.65 19.05,29.74 U$11.P$2
AIN2  (via drill 0.35)
  Top 0.305: v23.22,19.38 U1.3 | v57.86,20.73 66.04,20.73 66.45,20.32 J2.2
  Bottom 0.305: v23.22,19.38 27.56,19.38 29.69,21.51 53.75,21.51 54.53,20.73 v57.86,20.73
AMP_FAULT
  Top 0.305: R16.1 43.35,29.63 Q5.1
CANH  (via drill 0.35)  (3 unrouted)
  Top 0.305: J5.2 70.61,48.03 64.9,42.31 64.9,40.97 U$5.2 | 60.52,17.54 47.28,17.54 v47.24,17.58
  Bottom 0.305: 60.7,17.73 62.37,19.4 62.37,35.12 60.71,36.77 U$5.2 | R6.2 54.25,10.97 57.05,13.77 57.05,15.14 59.63,17.72 | v47.24,17.58 47.24,16.15 46.51,15.42 U$2.CANH
CANL  (2 unrouted)
  Top 0.305: J5.1 68.07,46.94 63.86,42.72 63.86,41.93 U$5.3
  Bottom 0.305: 60.06,19.72 59.36,20.43 59.36,37.43 U$5.3 | R7.1 41.19,15.79 42.85,14.12 45.48,14.12 U$2.CANL 47.02,14.15 48.08,15.21 48.08,18.06 49.74,19.72
CLK
  Top 0.305: U$1.SCK 35.66,50.8 34.47,51.99 24.05,51.99 20.32,48.26 J4.2
  Bottom 0.305: J4.2 17.35,48.26 14.66,45.57 14.66,37.43 13.54,36.32 PCB1.P$23
CS  (via drill 0.35)
  Top 0.305: PCB1.P$24 12.27,35.03 12.27,33.24 13,32.51 13.97,32.51 15.42,33.96 16.18,33.96 19.05,36.83 J4.5 19.89,39.8 28.27,39.8 30.76,42.29 v30.76,45.77 | v35.08,45.8 36.27,46.99 U$1.CS
  Bottom 0.305: v30.76,45.77 35.05,45.77 v35.08,45.8
DI  (via drill 0.35)
  Top 0.305: v17.12,44.45 15.11,46.46 PCB1.P$31 | v51.79,33.05 69.04,33.05 69.98,33.98 U$9.P$2 69.98,28.85 70.47,28.36 R20.1
  Bottom 0.305: v17.12,44.45 17.68,43.89 17.68,38.99 18.49,38.18 20.75,38.18 22.07,36.85 22.07,35.84 24.87,33.05 v51.79,33.05
DI1
  Top 0.305: PCB1.P$36 12.22,52.76 14.63,52.76 17.32,55.45 37.82,55.45 U$15.3
DI2
  Top 0.305: PCB1.P$38 12.37,55.45 14.25,55.45 14.88,56.08 36.46,56.08 U$15.2
DI3
  Top 0.305: PCB1.P$40 12.17,57.78 15.47,57.78 15.93,58.24 36.62,58.24 U$15.1
FAULT  (via drill 0.35)
  Top 0.305: v37.87,12.85 43.28,12.85 v43.31,12.88
  Bottom 0.305: R4.1 30.65,16.86 Q4.1 30.65,13.47 31.14,12.97 37.75,12.97 v37.87,12.85 | U$2.FAULT v43.31,12.88
GND  (via drill 0.35)
  Top 0.305: PCB1.P$6 8.87,13.44 6.4,15.9 U$6.P$4
  other vias: 31.75,15.49 38.1,15.24 43.18,16.51 53.59,18.29 27.18,16.26 36.58,40.89 39.12,40.89 46.74,23.62 45.72,19.81 28.7,24.38 50.04,59.94 50.04,55.63 55.12,59.94 51.05,42.42
  pour Top: 0,65.07 0,0 77.47,0 77.47,65.07
  pour Bottom: 0,64.77 0,0 77.47,0 77.47,64.77
IMU_INT
  Bottom 0.305: PCB1.P$13 13.72,23.77 23.14,23.77 24.79,25.43 24.79,26.47 25.55,27.23 38.12,27.23 39.37,25.98 U$3.INT
IMU_RESET  (via drill 0.35)
  Top 0.305: U$3.RST 41.99,10.08 31.42,10.08 29.67,11.84 v25.68,11.84 | v16.38,11.84 14.71,13.51 14.71,19.89 PCB1.P$11
  Bottom 0.305: v25.68,11.84 25.65,11.81 16.41,11.81 v16.38,11.84
INT
  Top 0.305: PCB1.P$35 14.1,52.09 19.66,52.09 20.52,52.96 35.33,52.96 36.22,52.07 U$1.INT
MISO
  Top 0.305: PCB1.P$21 13.54,34.65 15.16,36.27 15.95,36.27 16.54,36.85 16.54,42.22 17.5,43.18 J4.4 21.75,40.48 27.65,40.48 29.62,42.44 29.62,45.87 32,48.26 U$1.SO 37.57,48.28
MOSI
  Top 0.305: J4.3 22.43,45.72 24,47.3 24,50.16 25.07,51.23 32.74,51.23 34.44,49.53 U$1.SI 37.56,49.55
  Bottom 0.305: PCB1.P$19 15.54,33.22 15.54,44.63 16.64,45.72 J4.3
N$1
  Bottom 0.305: R3.1 44.25,18.64 45.5,17.39 U$2.S
N$2
  Top 0.305: R11.1 59.67,48.34 Y1.2 64.62,48.36 C1.2
N$3
  Top 0.305: R19.1 59.66,53.21 Y1.1 64.6,53.24 C2.2
N$6
  Bottom 0.305: R7.2 39.55,12.42 40.15,11.82 C6.1 41.36,11.79 42.19,11.79 43.03,10.95 44.39,10.95 R6.1
N$7
  Bottom 0.305: Q4.3 36.07,12.03 D2.C
N$8
  Bottom 0.305: R5.1 33.02,15.65 33.66,15.01 35.71,15.01 36.12,14.61 D2.A
N$9
  Top 0.305: R10.1 C4.1 R1.2 47.16,35.98 47.75,36.58 D1.A 50.68,37.46 R2.1
N$10
  Top 0.305: Q5.2 49.38,29.48 R17.2
N$11
  Top 0.305: R17.1 49.53,32.11 49.92,32.5 D4.A
OSC1
  Top 0.305: U$1.OSC1 48.97,53.34 50.32,51.99 51.79,51.99 53.01,53.21 R19.2
OSC2
  Top 0.305: U$1.OSC2 48.74,52.07 52.4,48.41 53.81,48.41 R11.2
PI_POWER
  Bottom 1.016: R21.1 R18.1 7.09,3.15 8.13,4.19 8.13,6.48 10.01,8.36 PCB1.P$2 PCB1.P$4
PWM
  Bottom 0.305: PCB1.P$33 13.56,49.02 14.68,49.02 16.69,51.03 16.69,53.16 17.45,53.92 40.06,53.92 45.03,48.95 50.34,48.95 54.53,44.76 64.85,44.76 66.43,43.17 69.14,43.17 U$12.P$2
RESET
  Top 0.305: U$1.RESET 41.15,45.72 43.18,43.69 R1.1
RESET_TO_PI  (via drill 0.35)
  Top 0.305: v30.87,37.6 26.94,37.6 22.4,33.07 v22.33,33.07 | v33.58,37.64 35.52,37.64 R10.2
  Bottom 0.305: PCB1.P$15 14.68,26.14 15.57,27.03 15.57,30.45 18.19,33.07 v22.33,33.07 | v33.58,37.64 33.54,37.6 v30.87,37.6
RX
  Top 0.305: PCB1.P$10 9.54,18.52 8.59,19.48 8.59,31.93 J8.3
RXCAN  (via drill 0.35)
  Top 0.305: v48.82,45.72 U$1.RXCAN | v55.45,21.46 55.45,18.72 v55.42,18.69
  Bottom 0.305: v48.82,45.72 52.6,45.72 55.45,42.88 v55.45,21.46 | v55.42,18.69 55.42,14.17 54.15,12.9 50.93,12.9 U$2.RXD
SCL  (via drill 0.35)
  Top 0.305: U$3.SCL R9.2 | PCB1.P$5 12.12,14.86 9.14,14.86 5.59,18.41 U$6.P$2 3.79,18.39 2.49,18.39 | Q1.2 16.92,25.58 16.92,24.69 17.46,24.14 R15.1 17.48,22.75 v17.48,21.29 | J3.2 22.96,2.44 25.09,2.44 27.36,4.7 35.66,4.7 v35.69,4.72 | v57.73,8.38 57.73,9.65 58.12,10.03 68.66,10.03 69.85,11.23 J1.2 | U$4.P$2 2.49,27.24 2.49,18.39 | 2.49,18.39 2.49,11.76 3.48,10.77 4.52,10.77 5.18,10.11 5.18,8.87 4.57,8.25 U$7.P$2
  Bottom 0.305: v35.69,4.72 35.71,4.7 38.99,4.7 U$3.SCL 42.62,7.62 43.91,6.33 46.84,6.33 48.9,8.38 v57.73,8.38 | J3.2 21.59,3.84 19.76,5.66 17.83,5.66 16.66,6.83 16.66,10.31 PCB1.P$5 15.44,15.34 15.44,20.57 16.15,21.29 v17.48,21.29
SCL_ADC  (via drill 0.35)
  Top 0.305: R14.2 20.89,25.82 20.04,26.67 Q1.3 18.88,26.03 19.58,25.32 v19.58,22.99 | U1.5 17.65,20.04 v18.09,20.47
  Bottom 0.305: v18.09,20.47 19.3,20.47 19.58,20.75 v19.58,22.99
SDA
  Top 0.305: R8.2 38.3,5.09 39.37,6.16 U$3.SDA 39.34,7.62 37.95,6.22 26.54,6.22 J3.3 21.86,6.08 Q3.2 17.88,7.94 R12.1 16.39,8.04 PCB1.P$3 13.54,11.25 12.68,12.12 9.75,12.12 8.69,11.05 8.69,10.19 5.5,7 U$7.P$3
  Bottom 0.305: U$3.SDA 40.95,9.2 68.89,9.2 J1.3 | U$4.P$3 3.81,27.29 4.67,26.42 4.67,17.17 | 4.67,17.17 3.83,17.17 U$6.P$3 | 4.67,17.17 4.67,11.38 5.64,10.41 5.64,8.6 4.04,7 U$7.P$3
SDA_ADC  (via drill 0.35)
  Top 0.305: Q3.3 23.96,12.65 23.5,13.12 R13.2 22.77,13.21 v21.49,13.21 | U1.6 16.97,19.28 17.7,19.28 18.36,18.61 18.36,16.33 18.77,15.93 v20.04,15.93
  Bottom 0.305: v20.04,15.93 20.55,15.42 20.55,13.69 21.03,13.21 v21.49,13.21
TX
  Top 0.305: PCB1.P$8 12.22,17.2 12.22,19.21 11.69,19.74 10.03,19.74 9.63,20.14 9.63,33.43 J8.2
TXCAN  (via drill 0.35)
  Top 0.305: v48.92,44.45 U$1.TXCAN | v52.38,22.4 52.43,22.35 v52.43,18.54
  Bottom 0.305: v48.92,44.45 52.17,44.45 54.25,42.37 54.25,24.28 v52.38,22.4 | v52.43,18.54 51.44,18.54 50.9,18.01 U$2.TXD

### Text on the board
tNames: ROV X12 PI Shield v1 / Katherine Sandys / Jacob Bobson / Cynthia Zatlokowicz